# Altium project fydp_proto1.PrjPcb (part 1 of 2)
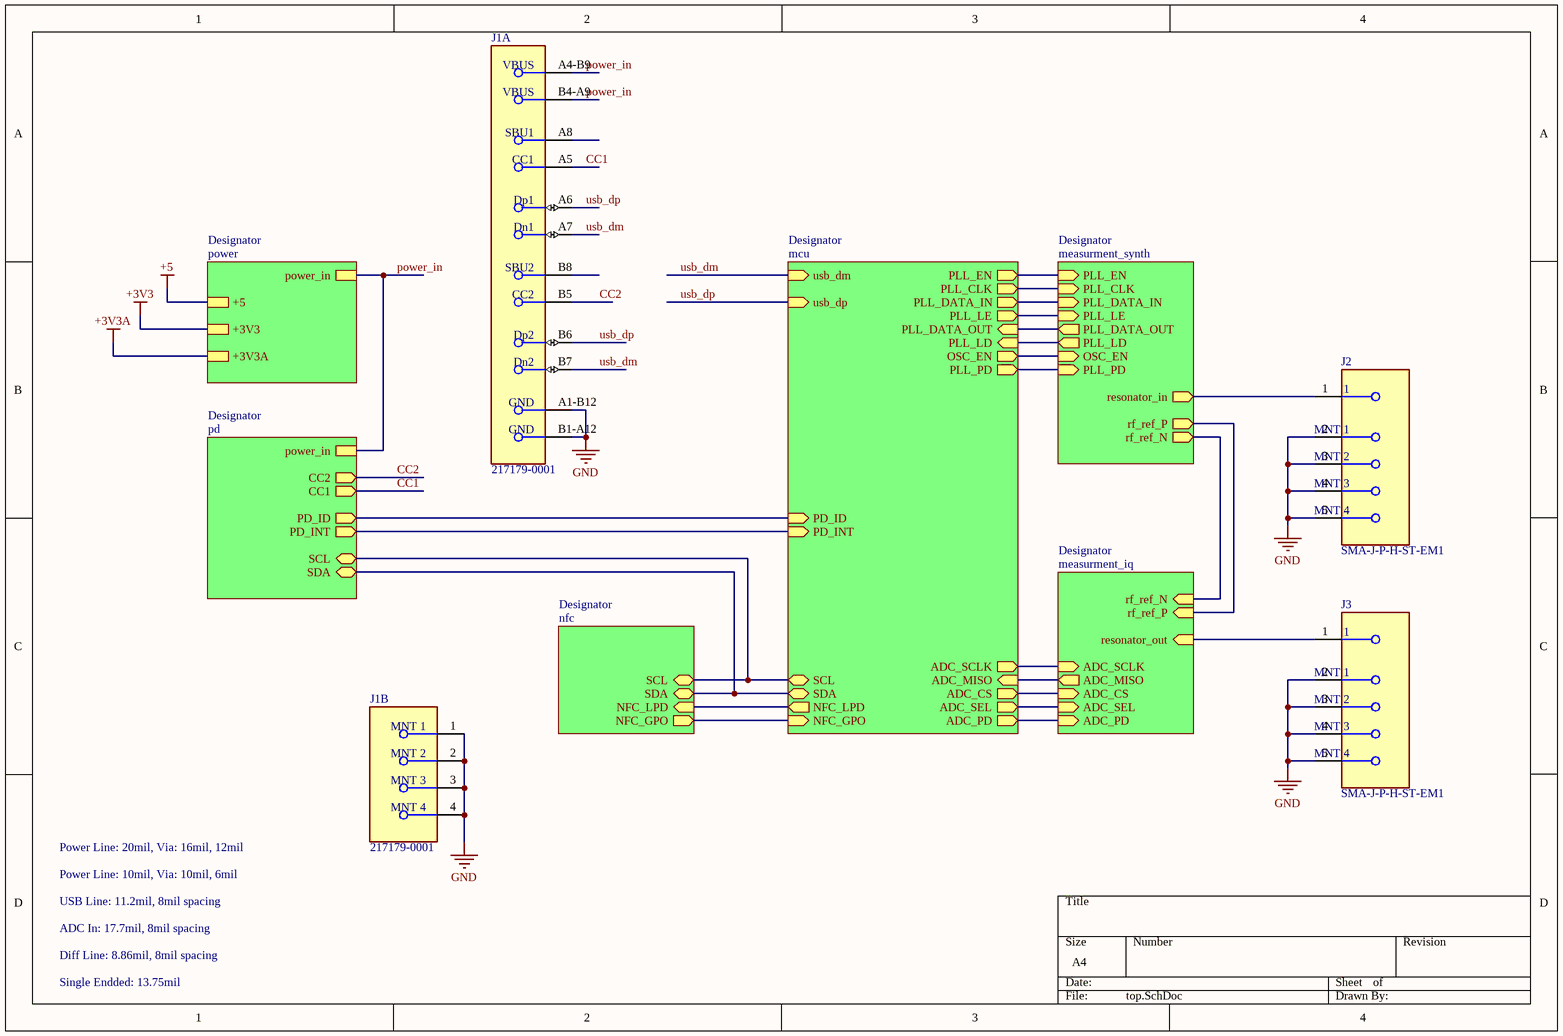
[diagram p0: top.SchDoc]
7 sheets, 138 parts. Net scope: hierarchical (ports join the sheet entries above them; power ports are global).
Board file: PCB1.PcbDoc
Sheets:
  top.SchDoc
    Designator = mcu.SchDoc
    Designator = measurment_synth.SchDoc
    Designator = power.SchDoc
    Designator = nfc.SchDoc
    Designator = measurment_iq.SchDoc
    Designator = pd.SchDoc

## Sheet top.SchDoc
size A4; SheetNumber: 1; SheetTotal: 7

### Parts
J1  217179-0001  [FP-2171790001-MFG]  (parts A,B of 2)
J2  SMA-J-P-H-ST-EM1  [FP-SMA-J-P-H-ST-EM1-MFG]
J3  SMA-J-P-H-ST-EM1  [FP-SMA-J-P-H-ST-EM1-MFG]

### Sub-sheets
Designator = mcu: usb_dm (in), usb_dp (in), SCL (bidir), SDA (bidir), NFC_LPD (out), NFC_GPO (in), PLL_EN (out), PLL_CLK (out), PLL_DATA_IN (out), PLL_DATA_OUT (in), PLL_LD (in), OSC_EN (out), PLL_PD (out), PLL_LE (out), ADC_SEL (out), ADC_SCLK (out), ADC_MISO (in), ADC_CS (out), ADC_PD (out), PD_INT (in), PD_ID (in)
Designator = measurment_synth: PLL_EN (in), PLL_CLK (in), PLL_DATA_IN (in), PLL_LE (in), PLL_DATA_OUT (out), PLL_LD (out), OSC_EN (in), PLL_PD (in), resonator_in (out), rf_ref_P (out), rf_ref_N (out)
Designator = power: power_in, +3V3, +3V3A, +5
Designator = nfc: NFC_GPO (out), NFC_LPD (in), SCL (bidir), SDA (bidir)
Designator = measurment_iq: resonator_out (in), ADC_SEL (in), ADC_SCLK (in), ADC_MISO (out), ADC_CS (in), ADC_PD (in), rf_ref_P (in), rf_ref_N (in)
Designator = pd: CC1 (out), CC2 (out), SCL (bidir), SDA (bidir), power_in, PD_INT (out), PD_ID (out)

### Nets
GND: J1.1(MNT_1) J1.2(MNT_2) J1.3(MNT_3) J1.4(MNT_4) J1.A1-B12(GND) J1.B1-A12(GND) J2.2(MNT_1) J2.3(MNT_2) J2.4(MNT_3) J2.5(MNT_4) J3.2(MNT_1) J3.3(MNT_2) J3.4(MNT_3) J3.5(MNT_4)
CC1: J1.A5(CC1) ; sheet Designator/CC1
CC2: J1.B5(CC2) ; sheet Designator/CC2
power_in: J1.A4-B9(VBUS) J1.B4-A9(VBUS) ; sheet Designator/power_in, sheet Designator/power_in
rf_ref_N: sheet Designator/rf_ref_N, sheet Designator/rf_ref_N
rf_ref_P: sheet Designator/rf_ref_P, sheet Designator/rf_ref_P
SCL: sheet Designator/SCL, sheet Designator/SCL, sheet Designator/SCL
SDA: sheet Designator/SDA, sheet Designator/SDA, sheet Designator/SDA
usb_dm: J1.A7(Dn1) J1.B7(Dn2) ; sheet Designator/usb_dm
usb_dp: J1.A6(Dp1) J1.B6(Dp2) ; sheet Designator/usb_dp
NetB1_1: J2.1 ; sheet Designator/resonator_in
NetB2_1: J3.1 ; sheet Designator/resonator_out
NetR11_1: sheet Designator/PD_ID, sheet Designator/PD_ID
NetR13_1: sheet Designator/PD_INT, sheet Designator/PD_INT
NetR21_1: sheet Designator/NFC_GPO, sheet Designator/NFC_GPO
NetU1_5: sheet Designator/NFC_LPD, sheet Designator/NFC_LPD
NetU1_11: sheet Designator/ADC_MISO, sheet Designator/ADC_MISO
NetU1_12: sheet Designator/ADC_CS, sheet Designator/ADC_CS
NetU1_13: sheet Designator/ADC_SCLK, sheet Designator/ADC_SCLK
NetU1_15: sheet Designator/ADC_PD, sheet Designator/ADC_PD
NetU1_16: sheet Designator/ADC_SEL, sheet Designator/ADC_SEL
NetU1_18: sheet Designator/OSC_EN, sheet Designator/OSC_EN
NetU1_28: sheet Designator/PLL_EN, sheet Designator/PLL_EN
NetU1_29: sheet Designator/PLL_CLK, sheet Designator/PLL_CLK
NetU1_30: sheet Designator/PLL_DATA_IN, sheet Designator/PLL_DATA_IN
NetU1_31: sheet Designator/PLL_LE, sheet Designator/PLL_LE
NetU1_32: sheet Designator/PLL_DATA_OUT, sheet Designator/PLL_DATA_OUT
NetU1_34: sheet Designator/PLL_LD, sheet Designator/PLL_LD
NetU1_35: sheet Designator/PLL_PD, sheet Designator/PLL_PD

Not connected (* = marked no-connect by the designer): J1 A8(SBU1) B8(SBU2)

### Notes on the sheet
- Power Line: 20mil, Via: 16mil, 12mil
- Power Line: 10mil, Via: 10mil, 6mil
- USB Line: 11.2mil, 8mil spacing
- Diff Line: 8.86mil, 8mil spacing
- Single Endded: 13.75mil
- ADC In: 17.7mil, 8mil spacing

### Library data of the parts
J1 = CMP-04767-000028-2: CONN RCP USB2.0 TYP C 24P SMD RA; NexarPartId: 117190526; Gender: Receptacle; Number of Contacts: 16; Current Rating: 1.25A; Voltage Rating: 30V; Min Operating Temperature: -40°C; USB Standard: USB 2.0; Height: 3.36mm; Contact Material: Gold, Nickel; Max Operating Temperature: 85°C
J2 J3 = CMP-02754-000006-1: CONN SMA JACK STR 50OHM EDGE MNT; Dielectric Material: PTFE; Center Contact Plating: Gold; Max Frequency: 6GHz; Body Material: Brass; Voltage Rating: 335V; Impedance: 50R; Package Quantity: 1; Case/Package: SMA; Max Operating Temperature: 125°C; Fastening Type: Threaded; Orientation: Straight; Depth: 13.33mm; RoHS Compliant: Yes; Length: 6.35mm; Insulation Material: Polytetrafluoroethylene; Termination: Solder; Min Operating Temperature: -65°C; Housing Color: Gold; Contact Plating: Gold; Contact Material: Copper; Connector Type: SMA; Mount: Edge; Series: SMA; Packaging: Tray; Body Plating: Gold; Radiation Hardening: No

## Sheet mcu.SchDoc
size A4; SheetNumber: 2; SheetTotal: 7
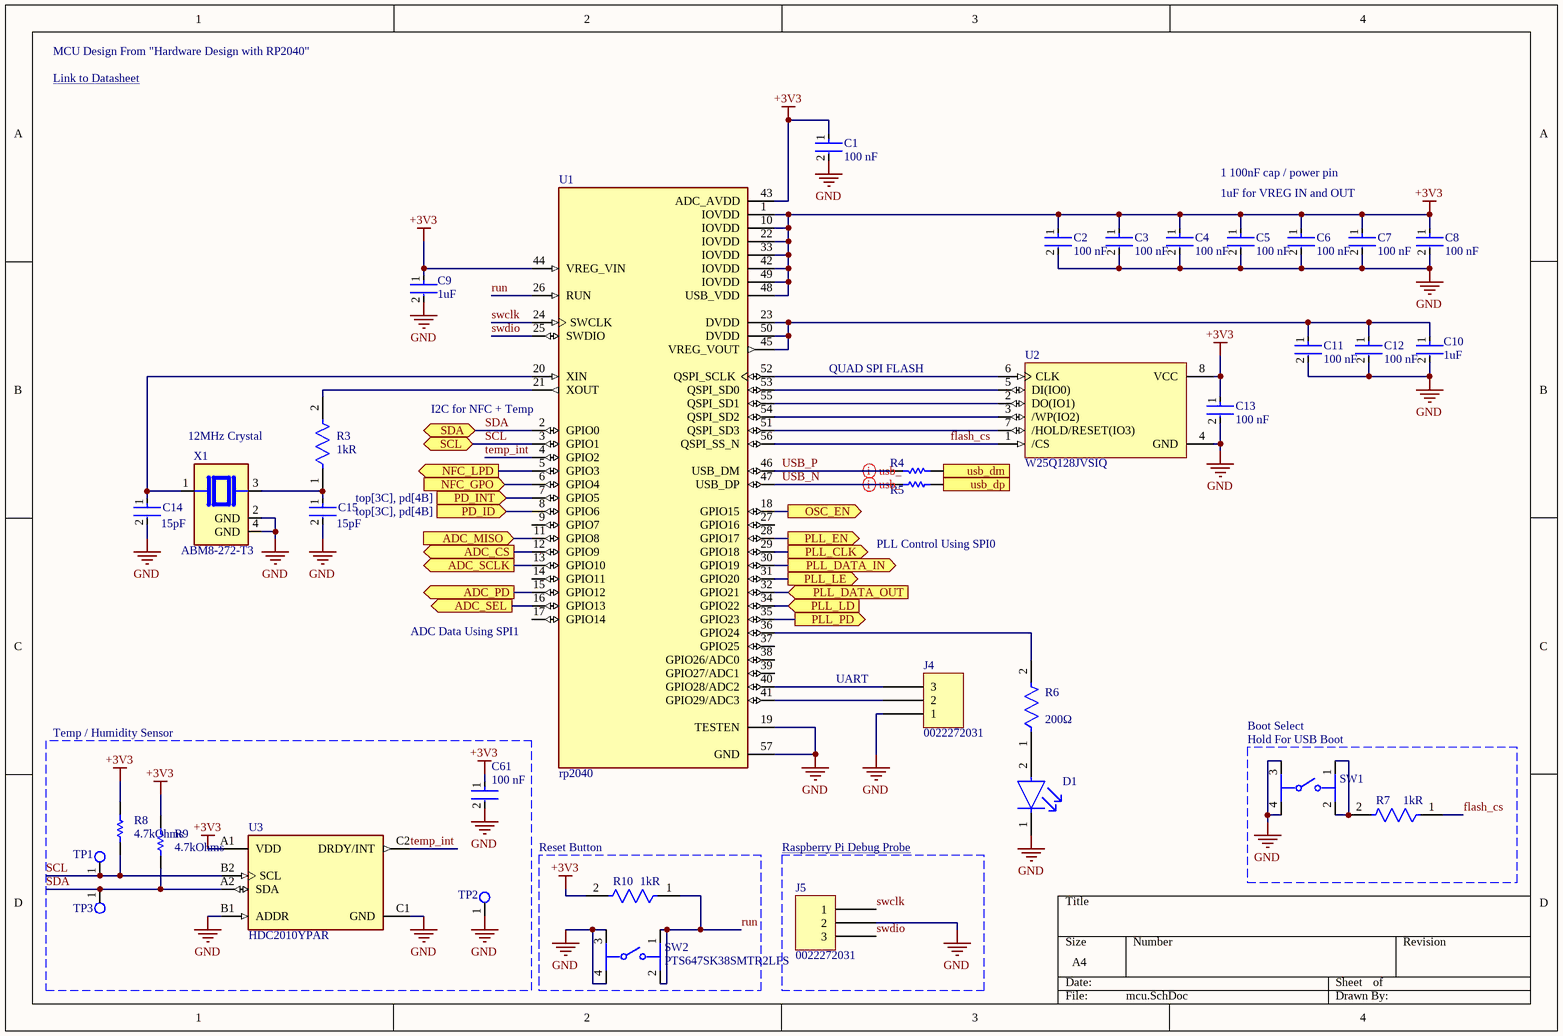
[diagram p1: mcu.SchDoc]

### Parts
C1  Capacitance: 100 nF  [FP-CC0603-DA-MFG]  (hidden comment: CC0603KRX7R7BB104)
C2  Capacitance: 100 nF  [FP-CC0603-DA-MFG]  (hidden comment: CC0603KRX7R7BB104)
C3  Capacitance: 100 nF  [FP-CC0603-DA-MFG]  (hidden comment: CC0603KRX7R7BB104)
C4  Capacitance: 100 nF  [FP-CC0603-DA-MFG]  (hidden comment: CC0603KRX7R7BB104)
C5  Capacitance: 100 nF  [FP-CC0603-DA-MFG]  (hidden comment: CC0603KRX7R7BB104)
C6  Capacitance: 100 nF  [FP-CC0603-DA-MFG]  (hidden comment: CC0603KRX7R7BB104)
C7  Capacitance: 100 nF  [FP-CC0603-DA-MFG]  (hidden comment: CC0603KRX7R7BB104)
C8  Capacitance: 100 nF  [FP-CC0603-DA-MFG]  (hidden comment: CC0603KRX7R7BB104)
C9  Capacitance: 1uF  [FP-CL10-IPC_C]  (hidden comment: CL10B105KP8NNNC)
C10  Capacitance: 1uF  [FP-CL10-IPC_C]  (hidden comment: CL10B105KP8NNNC)
C11  Capacitance: 100 nF  [FP-CC0603-DA-MFG]  (hidden comment: CC0603KRX7R7BB104)
C12  Capacitance: 100 nF  [FP-CC0603-DA-MFG]  (hidden comment: CC0603KRX7R7BB104)
C13  Capacitance: 100 nF  [FP-CC0603-DA-MFG]  (hidden comment: CC0603KRX7R7BB104)
C14  Capacitance: 15pF  [FP-GJM155-0_05-MFG]  (hidden comment: GJM1555C1H150GB01D)
C15  Capacitance: 15pF  [FP-GJM155-0_05-MFG]  (hidden comment: GJM1555C1H150GB01D)
C61  Capacitance: 100 nF  [FP-CC0603-DA-MFG]  (hidden comment: CC0603KRX7R7BB104)
D1  LTST-C190KRKT  [FP-LTST-C190KRKT-MFG]  (value not drawn)
J4  0022272031  [MOLEX KK 0022272031]
J5  0022272031  [MOLEX KK 0022272031]
R3  Resistance: 1kR  [FP-RC0603-0_55-IPC_C]  (hidden comment: RC0603FR-071KL)
R4  RC0402JR-0727RL  [RESC1005X40X25NL05T10]  (value not drawn)
R5  RC0402JR-0727RL  [RESC1005X40X25NL05T10]  (value not drawn)
R6  value 200Ω  [FP-RT0402-MFG]  (hidden comment: RT0402BRD07200RL)
R7  Resistance: 1kR  [FP-RC0603-0_55-IPC_C]  (hidden comment: RC0603FR-071KL)
R8  Resistance: 4.7kOhms  [RESC1608X55X25LL10T15]  (hidden comment: RC0603FR-074K7L)
R9  Resistance: 4.7kOhms  [RESC1608X55X25LL10T15]  (hidden comment: RC0603FR-074K7L)
R10  Resistance: 1kR  [FP-RC0603-0_55-IPC_C]  (hidden comment: RC0603FR-071KL)
SW1  PTS647SK38SMTR2LFS  [FP-PTS647SK38SMTR2LFS-MFG]  (value not drawn)
SW2  PTS647SK38SMTR2LFS  [FP-PTS647SK38SMTR2LFS-MFG]
TP1  Test Point  [test_point]  (value not drawn)
TP2  Test Point  [test_point]  (value not drawn)
TP3  Test Point  [test_point]  (value not drawn)
U1  rp2040  [QFN40P700X700X90-57N]
U2  W25Q128JVSIQ  [SOIC127P790X216-8N]
U3  HDC2010YPAR  [FP-YPA0006-MFG]
X1  ABM8-272-T3  [XTAL_ABM8-272-T3]

### Blocks framed on the sheet
Temp / Humidity Sensor: C61 R8 R9 TP1-TP3 U3
Reset Button: R10 SW2
Raspberry Pi Debug Probe: J5

### Ports
ADC_CS (out, see top[3C], measurment_iq[4B]), ADC_MISO (in, see top[3C], measurment_iq[4B]), ADC_PD (out, see top[3C], measurment_iq[4C]), ADC_SCLK (out, see top[3C], measurment_iq[4B]), ADC_SEL (out, see top[3C], measurment_iq[4C]), NFC_GPO (in, see top[3C], nfc[3B]), NFC_LPD (out, see top[3C], nfc[2B]), OSC_EN (out, see top[3B], measurment_synth[1B]), PD_ID (in, see top[3C], pd[4B]), PD_INT (in, see top[3C], pd[4B]), PLL_CLK (out, see top[3B], measurment_synth[2C]), PLL_DATA_IN (out, see top[3B], measurment_synth[2C]), PLL_DATA_OUT (in, see top[3B], measurment_synth[3C]), PLL_EN (out, see top[3B], measurment_synth[2B]), PLL_LD (in, see top[3B], measurment_synth[3B]), PLL_LE (out, see top[3B], measurment_synth[2C]), PLL_PD (out, see top[3B], measurment_synth[2B]), SCL (bidir, see top[3C], nfc[1B], pd[2C]), SDA (bidir, see top[3C], nfc[1B], pd[2C]), usb_dm (in, see top[3B]), usb_dp (in, see top[3B])

### Nets
+3V3: C1.1 C2.1 C3.1 C4.1 C5.1 C6.1 C7.1 C8.1 C9.1 C13.1 C61.1 R8.2 R9.2 R10.2 U1.1(IOVDD) U1.10(IOVDD) U1.22(IOVDD) U1.33(IOVDD) U1.42(IOVDD) U1.43(ADC_AVDD) U1.44(VREG_VIN) U1.48(USB_VDD) U1.49(IOVDD) U2.8(VCC) U3.A1(VDD)
GND: C1.2 C2.2 C3.2 C4.2 C5.2 C6.2 C7.2 C8.2 C9.2 C10.2 C11.2 C12.2 C13.2 C14.2 C15.2 C61.2 D1.1(C) J4.1 J5.2 SW1.3 SW1.4 SW2.3 SW2.4 TP2.1 U1.19(TESTEN) U1.57(GND) U2.4(GND) U3.B1(ADDR) U3.C1(GND) X1.2(GND) X1.4(GND)
flash_cs: R7.1 U1.56(QSPI_SS_N) U2.1(/CS)
run: R10.1 SW2.1 SW2.2 U1.26(RUN)
SCL: R8.1 TP1.1 U1.3(GPIO1) U3.B2(SCL) ; port SCL
SDA: R9.1 TP3.1 U1.2(GPIO0) U3.A2(SDA) ; port SDA
swclk: J5.1 U1.24(SWCLK)
swdio: J5.3 U1.25(SWDIO)
temp_int: U1.4(GPIO2) U3.C2(DRDY/INT)
usb_dm: R4.2 ; port usb_dm
usb_dp: R5.2 ; port usb_dp
USB_N: R5.1 U1.47(USB_DP)
USB_P: R4.1 U1.46(USB_DM)
NetC10_1: C10.1 C11.1 C12.1 U1.23(DVDD) U1.45(VREG_VOUT) U1.50(DVDD)
NetC14_1: C14.1 U1.20(XIN) X1.1
NetC15_1: C15.1 R3.1 X1.3
NetD1_2: D1.2(A) R6.1
NetJ4_2: J4.2 U1.41(GPIO29/ADC3)
NetJ4_3: J4.3 U1.40(GPIO28/ADC2)
NetR3_2: R3.2 U1.21(XOUT)
NetR6_2: R6.2 U1.36(GPIO24)
NetR7_2: R7.2 SW1.1 SW1.2
NetR11_1: U1.8(GPIO6) ; port PD_ID
NetR13_1: U1.7(GPIO5) ; port PD_INT
NetR21_1: U1.6(GPIO4) ; port NFC_GPO
NetU1_5: U1.5(GPIO3) ; port NFC_LPD
NetU1_11: U1.11(GPIO8) ; port ADC_MISO
NetU1_12: U1.12(GPIO9) ; port ADC_CS
NetU1_13: U1.13(GPIO10) ; port ADC_SCLK
NetU1_15: U1.15(GPIO12) ; port ADC_PD
NetU1_16: U1.16(GPIO13) ; port ADC_SEL
NetU1_18: U1.18(GPIO15) ; port OSC_EN
NetU1_28: U1.28(GPIO17) ; port PLL_EN
NetU1_29: U1.29(GPIO18) ; port PLL_CLK
NetU1_30: U1.30(GPIO19) ; port PLL_DATA_IN
NetU1_31: U1.31(GPIO20) ; port PLL_LE
NetU1_32: U1.32(GPIO21) ; port PLL_DATA_OUT
NetU1_34: U1.34(GPIO22) ; port PLL_LD
NetU1_35: U1.35(GPIO23) ; port PLL_PD
NetU1_51: U1.51(QSPI_SD3) U2.7(/HOLD/RESET(IO3))
NetU1_52: U1.52(QSPI_SCLK) U2.6(CLK)
NetU1_53: U1.53(QSPI_SD0) U2.5(DI(IO0))
NetU1_54: U1.54(QSPI_SD2) U2.3(/WP(IO2))
NetU1_55: U1.55(QSPI_SD1) U2.2(DO(IO1))

Not connected (* = marked no-connect by the designer): U1 9(GPIO7) 14(GPIO11) 17(GPIO14) 27(GPIO16) 37(GPIO25) 38(GPIO26/ADC0) 39(GPIO27/ADC1)

### Layout directives
differential pair: USB_N, USB_P

### Notes on the sheet
- MCU Design From "Hardware Design with RP2040"
- Link to Datasheet <https://datasheets.raspberrypi.com/rp2040/hardware-design-with-rp2040.pdf>
- 1 100nF cap / power pin
- 1uF for VREG IN and OUT
- QUAD SPI FLASH
- 12MHz Crystal
- (near U1) I2C for NFC + Temp
- PLL Control Using SPI0
- (near U1) ADC Data Using SPI1
- UART
- (near SW1) Hold For USB Boot
- Boot Select

### Library data of the parts
C1-C8 C11-C13 C61 = CMP-2000-05002-2: CAP CER 0.1UF 16V X7R 0603; Manufacturer: YAGEO; Tolerance: 0.1; Value: 100 nF; Temperature Coefficient: 15%; Material: Ceramic; Voltage Rating: 16 V; Package: CC0603-DA; ComponentLink2Description: Datasheet; Octopart: https://octopart.com/cc0603krx7r7bb104-yageo-192941; Temperature Range High: +125°C; Digikey Description: CAP CER 0.1UF 16V X7R 0603; Voltage: 16 V; Device Class L2: Capacitors; Height: 0.9mm; Temperature: -55°C to +125°C; Manufacturer Part Number: CC0603KRX7R7BB104; Device Class L1: Passive Components; Device Class L3: Ceramic Capacitors; ComponentLink2URL: http://www.yageo.com/documents/recent/UPY-GPHC_X7R_6.3V-to-50V_18.pdf; Footprint Url: http://www.yageo.com/exep/pages/download/literatures/UPY-C_GEN_24.pdf; RoHS: TRUE; Temperature Range Low: -55°C; Temperature Characteristic: X7R; Lead Free: Yes; Category: Cap; Mouser Description: Multilayer Ceramic Capacitor, CC Series, 0.1 - F, - 10%, X7R, 16 V, 0603 [1608 Metric]; Automotive: No
C9 C10 = CMP-2000-06094-2: Cap Ceramic 1uF 10V X7R ±10% Pad SMD 0603 +125°C T/R; Packaging: Tape and Reel; Depth: 0.8mm; Voltage Rating: 10V; Lead Free: Lead Free; Radiation Hardening: No; Length: 1.6mm; Package Quantity: 1; Mount: Surface Mount; Case/Package: 0603; Max Operating Temperature: 125°C; Case Code (Metric): 1608; Height: 0.8mm; Min Operating Temperature: -55°C; Dielectric: X7R; Contact Plating: Tin; Case Code (Imperial): 0603; Thickness: 0.035inch; Voltage Rating (DC): 10V; Tolerance: 10%; Width: 0.031inch
C14 C15 = CMP-2008-03803-2: Multi-Layer Ceramic Capacitor 15pF C0G  ±2% 0402 Paper T/R; Voltage Rating: 50V; Termination: SMD/SMT; Min Operating Temperature: -55°C; Case Code (Imperial): 0402; Depth: 0.5mm; Case/Package: 0402; Max Operating Temperature: 125°C; Lead Free: Lead Free; Width: 0.02inch; Mount: Surface Mount; Radiation Hardening: No; Case Code (Metric): 1005; Length: 1mm; Height: 0.5mm; Package Quantity: 10000; Packaging: Tape and Reel; Voltage Rating (DC): 50V; Tolerance: 2%; Dielectric: C0G; Thickness: 0.022inch
D1 = CMP-1674-00011-2: LED RED CLEAR CHIP SMD; Reverse Voltage: 5V; Viewing Angle: 130°; Power Rating: 75mW; Test Current: 20mA; Number of Elements: 1; Lens Color: Colorless; Wavelength: 639nm; Dominant Wavelength: 631nm; Lens Style: Diffused; Forward Current: 30mA; Forward Voltage: 2.4V; Luminous Intensity: 54mcd; Color: Red; Case Code (Imperial): 0603; Lens Transparency: Clear; Lead Free: Lead Free; Package Quantity: 1; Packaging: Tape and Reel; Max Operating Temperature: 85°C; Number of Pins: 2; Height: 0.8mm; Case/Package: 0603; Number of LEDs: 1; Width: 0.8mm; Case Code (Metric): 1608; Depth: 0.8mm; Mount: Surface Mount; Radiation Hardening: No; Length: 1.6mm; Illumination Color: Red; Power Dissipation: 75mW; Min Operating Temperature: -55°C
J4 J5 = 0022272031: CONN HEADER VERT 3POS 2.54MM; Manufacturer: Molex; Contact Length - Mating: 0.295" (7.49mm); Contact Length - Post: 0.140" (3.56mm); Material Flammability Rating: UL94 V-0; Number of Positions: 3; Number of Positions Loaded: All; Overall Contact Length: 0.560" (14.22mm); Pitch - Mating: 0.100" (2.54mm); Shrouding: Shrouded - 1 Wall; Style: Board to Cable/Wire; Part Number: 0022272031; ComponentLink1Description: Datasheet; ComponentLink1URL: https://www.molex.com/pdm_docs/sd/022272031_sd.pdf; ComponentLink2Description: DigiKey Link; ComponentLink2URL: http://digikey.com/product-detail/en/molex/0022272031/WM4112-ND/1130578; Connector Type: Header; Contact Finish - Mating: Tin; Contact Finish - Post: Tin; Contact Finish Thickness - Mating: 100.0µin (2.54µm); Contact Material: Brass; Contact Shape: Square; Contact Type: Male Pin; Fastening Type: Friction Lock; Insulation Color: Natural; Insulation Height: 0.461" (11.70mm); Insulation Material: Polyamide (PA), Nylon; LastUpdated: 1/12/2020 11:51:54 PM; Lifecycle Status: Active; Minimum Order: 1; Mounting Type: Through Hole; Number of Rows: 1; Packaging: Bulk; PartId: 77; Part Status: Active; Price: 0.37; Series: KK 6410; Supplier 1: DigiKey; Supplier Part Number 1: WM4112-ND; Termination: Solder
R3 R7 R10 = CMP-1659-00009-5: RES 1K OHM 1% 1/10W 0603; Voltage Rating: 50V; Power Rating: 100mW; Temperature Coefficient: 100ppm/°C; Military Standard: Not; REACH SVHC: No SVHC; Size Code: 0603; Features: Moisture Resistant; Number of Terminations: 2; Technology: THICK FILM; Series: RC; Case Code (Metric): 1608; Resistance Tolerance: 1%; Resistor Type: Thick Film; Termination: SMD/SMT; Contact Plating: Tin; Radiation Hardening: No; Min Operating Temperature: -55°C; Max Operating Temperature: 155°C; Packaging: Tape and Reel; Max Power Dissipation: 100mW; RoHS Compliant: Yes; Height: 0.45mm; Lead Free: Lead Free; Case/Package: 0603; Length: 1.6mm; Tolerance: 1%; Case Code (Imperial): 0603; Construction: Rectangular; Depth: 0.8mm
R4 R5 = CMP-1011-00036-2: Manufacturer: Yageo / Phycomp; Part Number: RC0402JR-0727RL
R6 = CMP-03412-023045-1: RES SMD 200 OHM 0.1% 1/16W 0402; Manufacturer: Yageo; Tolerance: 0.001; Voltage Rating: 50V; Temperature Coefficient: 25 ppm/°C; Power Rating: 0.063W; Device Class L2: Resistors; RoHS: TRUE; Series: RT; Resistance: 200Ω; Mouser Description: Thin Film Resistors - SMD 1/16W 200 ohm .1% 25ppm; Manufacturer Part Number: RT0402BRD07200RL; Footprint Url: http://www.yageo.com/exep/pages/download/literatures/PYu-R_Mount_10.pdf; ComponentLink2URL: http://www.yageo.com/documents/recent/PYu-RT_1-to-0.01_RoHS_L_9.pdf; Device Class L1: Passive Components; Height: 0.35mm; Temperature: -55°C to +155°C; Temperature Range High: +155°C; Package: RT0402; Device Class L3: Chip SMD Resistors; Lead Free: Yes; Ipc Land Pattern Name: RESC10050X30; Category: Res; Digikey Description: RES SMD 200 OHM 0.1% 1/16W 0402; Automotive: No; ComponentLink2Description: Datasheet; Composition: Thin Film; Temperature Range Low: -55°C; Octopart: https://octopart.com/rt0402brd07200rl-yageo-1238579
R8 R9 = CMP-2000-06942-1: Chip Resistor, 4.7 KOhm, +/- 1%, 0.1 W, -55 to 155 degC, 0603 (1608 Metric), RoHS, Tape and Reel; Manufacturer: Yageo; Power Rating: 100mW; Temperature Coefficient: 100PPM/C; Voltage Rating: 50V; Package Reference: 0603; Series: RC; Datasheet Version: Rev. 7, 05/2017; Packaging: Reel; Termination Style: SMD/SMT; Datasheet URL: http://www.yageo.com/documents/recent/PYu-RC_Group_51_RoHS_L_7.pdf; Manufacturer URL: http://www.yageo.com/; Package Description: 2-Pin Surface Mount Device, Body 1.6 x 0.8 mm; Case Code - mm: 1608; Case Code - in: 0603; Mounting Technology: SurfaceMount; Operating Temperature Range: -55Cto+155C; Tolerance: 1%; Product: ThickFilmResistorsGeneralPurpose
SW1 SW2 = CMP-10040-000033-1: TACT 4.5 X 4.5, 3.8 MM H, 2.5N,; Switch Function: Off-Mom; Switch Travel: 0.25mm; Actuator Type: Standard; Illumination Type: Non-Illuminated; Mechanical Life: 100000Cycles; Ratings: IP40; Operating Force: 250gf; Throw Configuration: SPST; Max Operating Temperature: 70°C; Min Operating Temperature: -20°C; Termination: Gull Wing; Mount: Surface Mount; Packaging: Tape and Reel
U3 = CMP-04948-000007-1: GEN 2 HUMIDITY SENSOR; Manufacturer: Texas Instruments; Resolution: 14bits; Sensor Output: I2C; Operating Supply Current: 0.105-650uA; Accuracy: 2%; Min Supply Voltage: 1.62V; Max Supply Voltage: 3.6V; Standoff Height: 0.215mm; Digikey Description: GEN 2 HUMIDITY SENSOR; ComponentLink2URL: http://www.ti.com/lit/ds/symlink/hdc2010.pdf; ComponentLink2Description: Datasheet; RoHS: TRUE; Category: IC; Automotive: No; Ipc Land Pattern Name: BGA6N50P2X3_146X146X67; Device Class L1: Sensors; Height: 0.675mm; Mouser Description: Low Power Humidity and Temperature Digital Sensor 6-DSBGA -40 to 85; Package: YPA0006; Manufacturer Part Number: HDC2010YPAR; Temperature: -40°C to +85°C; Device Class L3: unset; Temperature Range High: +85°C; Lead Free: Yes; Interface: I2C; Device Class L2: Temperature and Humidity Sensors; Temperature Range Low: -40°C; Octopart: https://octopart.com/hdc2010ypar-texas+instruments-84791680

## Sheet measurment_synth.SchDoc
size A4; SheetNumber: 4; SheetTotal: 7
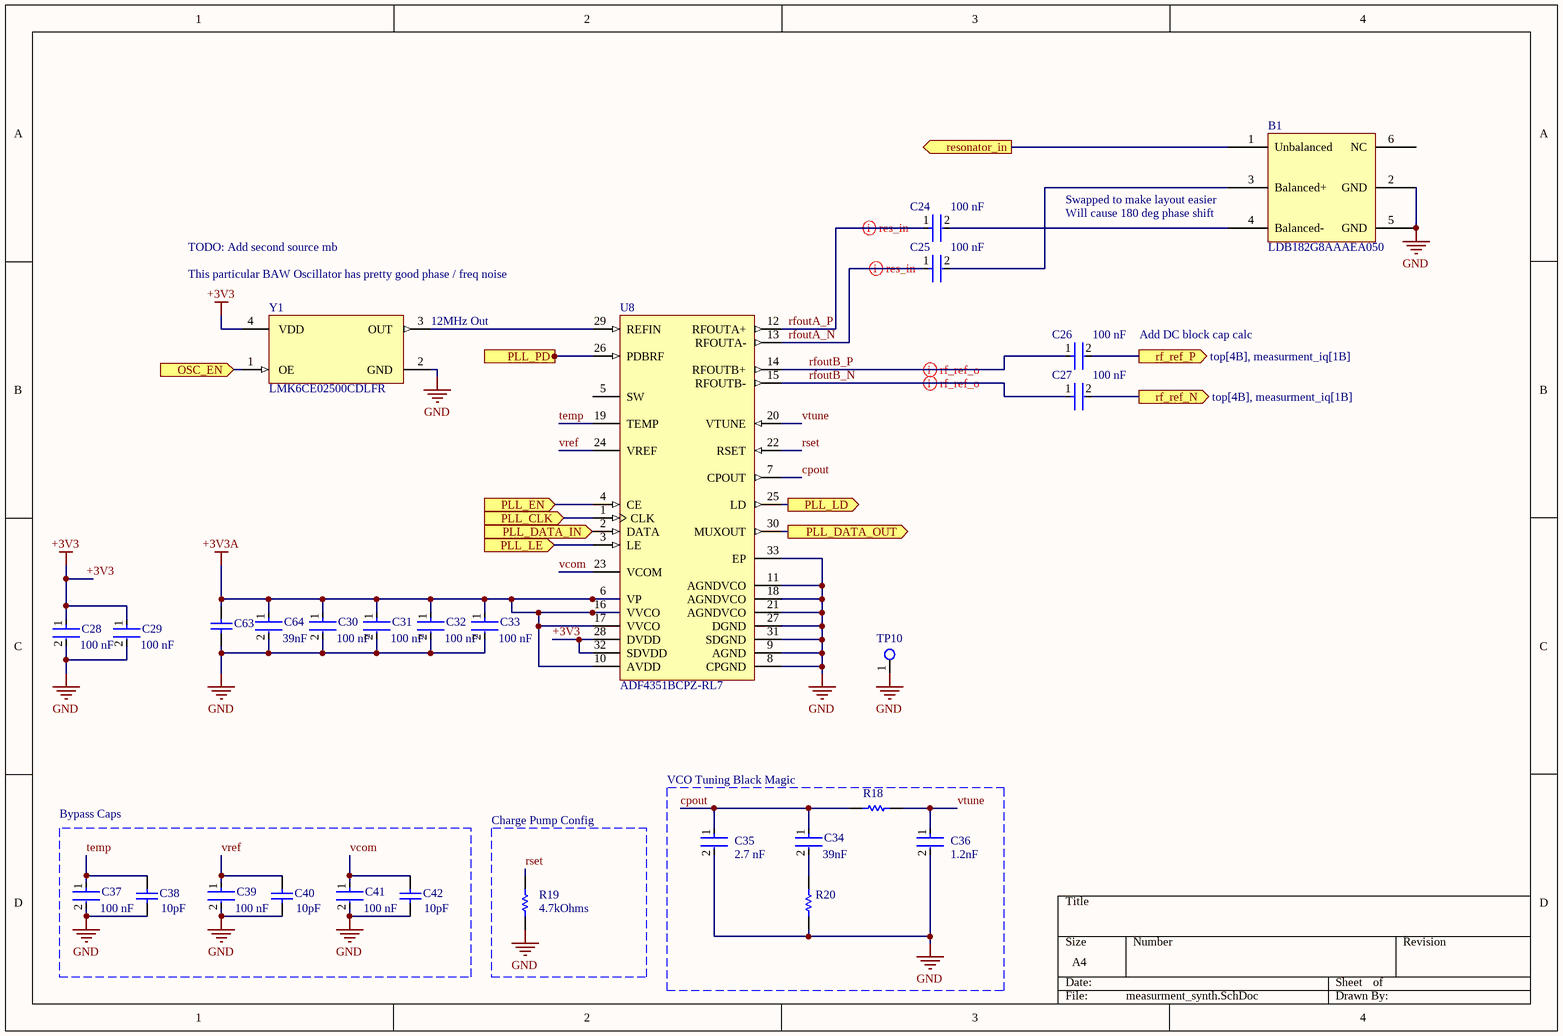
[diagram p2: measurment_synth.SchDoc]

### Parts
B1  LDB182G8AAAEA050  [Balum]
C24  Capacitance: 100 nF  [FP-CC0603-DA-MFG]  (hidden comment: CC0603KRX7R7BB104)
C25  Capacitance: 100 nF  [FP-CC0603-DA-MFG]  (hidden comment: CC0603KRX7R7BB104)
C26  Capacitance: 100 nF  [FP-CC0603-DA-MFG]  (hidden comment: CC0603KRX7R7BB104)
C27  Capacitance: 100 nF  [FP-CC0603-DA-MFG]  (hidden comment: CC0603KRX7R7BB104)
C28  Capacitance: 100 nF  [FP-CC0603-DA-MFG]  (hidden comment: CC0603KRX7R7BB104)
C29  Capacitance: 100 nF  [FP-CC0603-DA-MFG]  (hidden comment: CC0603KRX7R7BB104)
C30  Capacitance: 100 nF  [FP-CC0603-DA-MFG]  (hidden comment: CC0603KRX7R7BB104)
C31  Capacitance: 100 nF  [FP-CC0603-DA-MFG]  (hidden comment: CC0603KRX7R7BB104)
C32  Capacitance: 100 nF  [FP-CC0603-DA-MFG]  (hidden comment: CC0603KRX7R7BB104)
C33  Capacitance: 100 nF  [FP-CC0603-DA-MFG]  (hidden comment: CC0603KRX7R7BB104)
C34  Capacitance: 39nF  [FP-GCM155-0_05-IPC_B]  (hidden comment: GCM155R71C393KA37D)
C35  Capacitance: 2.7 nF  [FP-CC0402-MFG]  (hidden comment: CC0402KPX7R9BB272)
C36  Capacitance: 1.2nF  [FP-GCM188-0_1-IPC_A]  (hidden comment: GCM1885C1H122JA16J)
C37  Capacitance: 100 nF  [FP-CC0603-DA-MFG]  (hidden comment: CC0603KRX7R7BB104)
C38  Capacitance: 10pF  [CAPC1005X55X25ML05T05]  (hidden comment: CC0402JRNPO9BN100)
C39  Capacitance: 100 nF  [FP-CC0603-DA-MFG]  (hidden comment: CC0603KRX7R7BB104)
C40  Capacitance: 10pF  [CAPC1005X55X25ML05T05]  (hidden comment: CC0402JRNPO9BN100)
C41  Capacitance: 100 nF  [FP-CC0603-DA-MFG]  (hidden comment: CC0603KRX7R7BB104)
C42  Capacitance: 10pF  [CAPC1005X55X25ML05T05]  (hidden comment: CC0402JRNPO9BN100)
C63  GRM1555C1H270JA01D  [CAPC1005X55X25LL05T10]  (value not drawn)
C64  Capacitance: 39nF  [FP-GCM155-0_05-IPC_B]  (hidden comment: GCM155R71C393KA37D)
R18  RC0402JR-07680RL  [RESC1005X40X25LL05T10]  (value not drawn)
R19  Resistance: 4.7kOhms  [RESC1608X55X25LL10T15]  (hidden comment: RC0603FR-074K7L)
R20  RC0603JR-07360RL  [RESC1608X55X25ML10T15]  (value not drawn)
TP10  Test Point  [test_point]  (value not drawn)
U8  ADF4351BCPZ-RL7  [ADI-CP-32-2_L]
Y1  LMK6CE02500CDLFR  [DLF0004A_MFG]

### Blocks framed on the sheet
Bypass Caps: C37-C42
Charge Pump Config: R19
VCO Tuning Black Magic: C34-C36 R18 R20

### Ports
OSC_EN (in, see top[3B], mcu[3B]), PLL_CLK (in, see top[3B], mcu[3C]), PLL_DATA_IN (in, see top[3B], mcu[3C]), PLL_DATA_OUT (out, see top[3B], mcu[3C]), PLL_EN (in, see top[3B], mcu[3C]), PLL_LD (out, see top[3B], mcu[3C]), PLL_LE (in, see top[3B], mcu[3C]), PLL_PD (in, see top[3B], mcu[3C]), resonator_in (out, see top[4B]), rf_ref_N (out, see top[4B], measurment_iq[1B]), rf_ref_P (out, see top[4B], measurment_iq[1B])

### Nets
+3V3: C28.1 C29.1 U8.28(DVDD) U8.32(SDVDD) Y1.4(VDD)
+3V3A: C30.1 C31.1 C32.1 C33.1 C63.2 C64.1 U8.6(VP) U8.10(AVDD) U8.16(VVCO) U8.17(VVCO)
GND: B1.2(GND) B1.5(GND) C28.2 C29.2 C30.2 C31.2 C32.2 C33.2 C35.2 C36.2 C37.2 C38.1 C39.2 C40.1 C41.2 C42.1 C63.1 C64.2 R19.1 R20.1 TP10.1 U8.8(CPGND) U8.9(AGND) U8.11(AGNDVCO) U8.18(AGNDVCO) U8.21(AGNDVCO) U8.27(DGND) U8.31(SDGND) U8.33(EP) Y1.2(GND)
cpout: C34.1 C35.1 R18.1 U8.7(CPOUT)
rf_ref_N: C27.2 ; port rf_ref_N
rf_ref_P: C26.2 ; port rf_ref_P
rfoutA_N: C25.1 U8.13(RFOUTA-)
rfoutA_P: C24.1 U8.12(RFOUTA+)
rfoutB_N: C27.1 U8.15(RFOUTB-)
rfoutB_P: C26.1 U8.14(RFOUTB+)
rset: R19.2 U8.22(RSET)
temp: C37.1 C38.2 U8.19(TEMP)
vcom: C41.1 C42.2 U8.23(VCOM)
vref: C39.1 C40.2 U8.24(VREF)
vtune: C36.1 R18.2 U8.20(VTUNE)
NetB1_1: B1.1(Unbalanced) ; port resonator_in
NetB1_3: B1.3(Balanced+) C25.2
NetB1_4: B1.4(Balanced-) C24.2
NetC34_2: C34.2 R20.2
NetU1_18: Y1.1(OE) ; port OSC_EN
NetU1_28: U8.4(CE) ; port PLL_EN
NetU1_29: U8.1(CLK) ; port PLL_CLK
NetU1_30: U8.2(DATA) ; port PLL_DATA_IN
NetU1_31: U8.3(LE) ; port PLL_LE
NetU1_32: U8.30(MUXOUT) ; port PLL_DATA_OUT
NetU1_34: U8.25(LD) ; port PLL_LD
NetU1_35: U8.26(PDBRF) ; port PLL_PD
NetU8_29: U8.29(REFIN) Y1.3(OUT)

Not connected (* = marked no-connect by the designer): B1 6(NC); U8 5(SW)

### Layout directives
differential pair: rfoutA_N, rfoutA_P, rfoutB_N, rfoutB_P

### Notes on the sheet
- TODO: Add second source mb
- (near B1) Swapped to make layout easier
- (near B1) Will cause 180 deg phase shift
- This particular BAW Oscillator has pretty good phase / freq noise
- (near Y1) 12MHz Out
- Add DC block cap calc

### Library data of the parts
C24-C33 C37 C39 C41 = CMP-2000-05002-2: as C1 on sheet mcu; Voltage Rating: 16 V; Package: CC0603-DA; ComponentLink2Description: Datasheet; Octopart: https://octopart.com/cc0603krx7r7bb104-yageo-192941; Temperature Range High: +125°C; Digikey Description: CAP CER 0.1UF 16V X7R 0603; Voltage: 16 V; Device Class L2: Capacitors; Height: 0.9mm; Temperature: -55°C to +125°C; Manufacturer Part Number: CC0603KRX7R7BB104; Device Class L1: Passive Components; Device Class L3: Ceramic Capacitors; ComponentLink2URL: http://www.yageo.com/documents/recent/UPY-GPHC_X7R_6.3V-to-50V_18.pdf; Footprint Url: http://www.yageo.com/exep/pages/download/literatures/UPY-C_GEN_24.pdf; RoHS: TRUE; Temperature Range Low: -55°C; Temperature Characteristic: X7R; Lead Free: Yes; Category: Cap; Mouser Description: Multilayer Ceramic Capacitor, CC Series, 0.1 - F, - 10%, X7R, 16 V, 0603 [1608 Metric]; Automotive: No
C34 C64 = CMP-06035-054841-1: Ceramic Capacitor for Automotive 39nF ±10% 16VDC X7R 0402 Paper T/R; Voltage Rating: 16V; Max Operating Temperature: 125°C; Case Code (Imperial): 0402; Mount: Surface Mount; Packaging: Cut Tape; Tolerance: 10%; Min Operating Temperature: -55°C; Ratings: AEC-Q200; Case Code (Metric): 1005; Case/Package: 0402
C35 = CMP-03422-000661-1: CC0402 2.7 nF X7R 10.00% 50 V; Manufacturer: YAGEO; Material: Ceramic; Automotive Grade: NA; Voltage Rating: 50 V; Value: 2.7 nF; Temperature Coefficient: 30ppm/°C; Tolerance: 0.1; Temperature Range Low: -55°C; Manufacturer Part Number: CC0402KPX7R9BB272; Temperature Range High: +125°C; Package: CC0402; Temperature: -55°C to +125°C; ComponentLink2Description: Datasheet; Temperature Characteristic: X7R; Lead Free: Yes; Footprint Url: http://www.yageo.com/exep/pages/download/literatures/UPY-C_GEN_24.pdf; Device Class L3: Ceramic Capacitors; RoHS: TRUE; Automotive: No; Category: Cap; Device Class L2: Capacitors; ComponentLink2URL: http://www.yageo.com/documents/recent/UPY-GP_NP0_16V-to-50V_16.pdf; Device Class L1: Passive Components; Octopart: https://octopart.com/cc0402kpx7r9bb272-yageo-84795372; Height: 0.55mm; Ipc Land Pattern Name: CAPC10050X50
C36 = CMP-06035-017544-1: Ceramic Capacitor for Automotive 1.2nF  ±5% 50VDC C0G 0603 Paper T/R; Voltage Rating: 50V; Ratings: AEC-Q200; Dielectric: C0G; Width: 0.031inch; Max Operating Temperature: 125°C; Mount: Surface Mount; Height: 0.8mm; Min Operating Temperature: -55°C; Packaging: Tape and Reel; Thickness: 0.035inch; Case/Package: 0603; Package Quantity: 10000; Weight: 0.000222oz; Case Code (Metric): 1608; Tolerance: 5%; Case Code (Imperial): 0603; Voltage Rating (DC): 50V; Termination: SMD/SMT; Length: 0.063inch
C38 C40 C42 = CMP-2100-03589-1: Chip Capacitor, 10 pF, +/- 5%, 50 V, -55 to 125 degC, 0402 (1005 Metric), RoHS, Tape and Reel; Manufacturer: Yageo; Insulation Resistance: 100GR; Voltage Rating (DC): 50V; Dielectric Material: Ceramic; Temperature Coefficient: 30ppm/degC; Dielectric: C0G; Termination: SMD/SMT; Package Reference: 0402; Lead Free: LeadFree; Composition: Ceramic; Tolerance: 5%; Case Code (Metric): 1005; Voltage Rating: 50V; Packaging: TapeandReel; Manufacturer URL: http://www.yageo.com/; REACH SVHC: NoSVHC; Max Operating Temperature: 125degC; Length: 1mm; Mount: SurfaceMount; Depth: 0.5mm; Min Operating Temperature: -55degC; Number of Pins: 2; Width: 0.02inch; Datasheet Version: Rev. 14, 07/2016; Package Quantity: 1; Datasheet URL: http://www.yageo.com/documents/recent/UPY-GP_NP0_16V-to-50V_14.pdf; Case Code (Imperial): 0402; RoHSCompliant: True; Radiation Hardening: No; Height: 0.5mm; Case/Package: 0402; Thickness: 0.022inch; Package Description: 2-Pin Surface Mount Device, Body 1 x 0.5 mm; Voltage: 50V
C63 = CMP-2008-03917-1: Manufacturer: Murata; Part Number: GRM1555C1H270JA01D
R18 = CMP-2002-08032-1: Manufacturer: Yageo / Phycomp; Part Number: RC0402JR-07680RL
R19 = CMP-2000-06942-1: as R8 on sheet mcu; Package Reference: 0603; Series: RC; Datasheet Version: Rev. 7, 05/2017; Packaging: Reel; Termination Style: SMD/SMT; Datasheet URL: http://www.yageo.com/documents/recent/PYu-RC_Group_51_RoHS_L_7.pdf; Manufacturer URL: http://www.yageo.com/; Package Description: 2-Pin Surface Mount Device, Body 1.6 x 0.8 mm; Case Code - mm: 1608; Case Code - in: 0603; Mounting Technology: SurfaceMount; Operating Temperature Range: -55Cto+155C; Tolerance: 1%; Product: ThickFilmResistorsGeneralPurpose
R20 = CMP-2000-04266-1: Manufacturer: Yageo; Part Number: RC0603JR-07360RL
U8 = CMP-0287-00015-1: Wideband Synthesizer with Integrated VCO, CP-32-2, Pb-Free, 1500 Reel; Max RF Input (MHz): 4.4GHz; RF Prescalers: 4/5,8/9; Max REFin (MHz): 250MHz; Frequency Range: 35MHz-4.4GHz; Norm Phase Noise (dBc/Hz): -221dBc; Supply Current: 110mA; Single/Dual: Single; PackageVersion: Jan-2005; ComponentLink3URL: http://www.analog.com/static/imported-files/packages/414143737956480539664569CP_32_2.pdf; PackageReference: CP-32-2; ComponentLink2URL: http://www.analog.com/static/imported-files/data_sheets/ADF4351.pdf; ComponentLink1URL: www.analog.com; ComponentLink1Description: Manufacturer URL; ComponentLink2Description: Datasheet; ComponentLink3Description: Package Specification; PackageDescription: 32-Lead Lead Frame Chip Scale Package [LFCSP_VQ]; DatasheetVersion: Rev. Pr D; Code_JEDEC: MO-220-VHHD-2
Y1 = CMP-00370-144810711-1: "LOW-JITTER, HIGH-PERFORMANCE, BU" 25 MHz LVCMOS Oscillator 1.8V Enable/Disable 4-VDFN; Manufacturer Lifecycle Status: ACTIVE; Load Capacitance: 30pF; Frequency: 25MHz; Max Junction Temperature (Tj): 125°C; Max Supply Voltage: 1.9V; Min Supply Voltage: 1.7V; Height: 1mm; Min Operating Temperature: -40°C; HelpURL: https://www.ti.com/lit/ds/symlink/lmk6c.pdf; ComponentLink1URL: http://ti.com; Number of Pins: 4; ComponentLink2Description: Datasheet URL; ComponentLink2URL: https://www.ti.com/lit/ds/symlink/lmk6c.pdf; Max Operating Temperature: 105°C; Thickness: 900µm; Ambient Temperature Range High: 105°C; Length: 2.5mm; ComponentLink1Description: Manufacturer's Website; Width: 2mm; Lifecycle Status: Production; RoHS: Compliant

## Sheet power.SchDoc
size A4; SheetNumber: 3; SheetTotal: 7
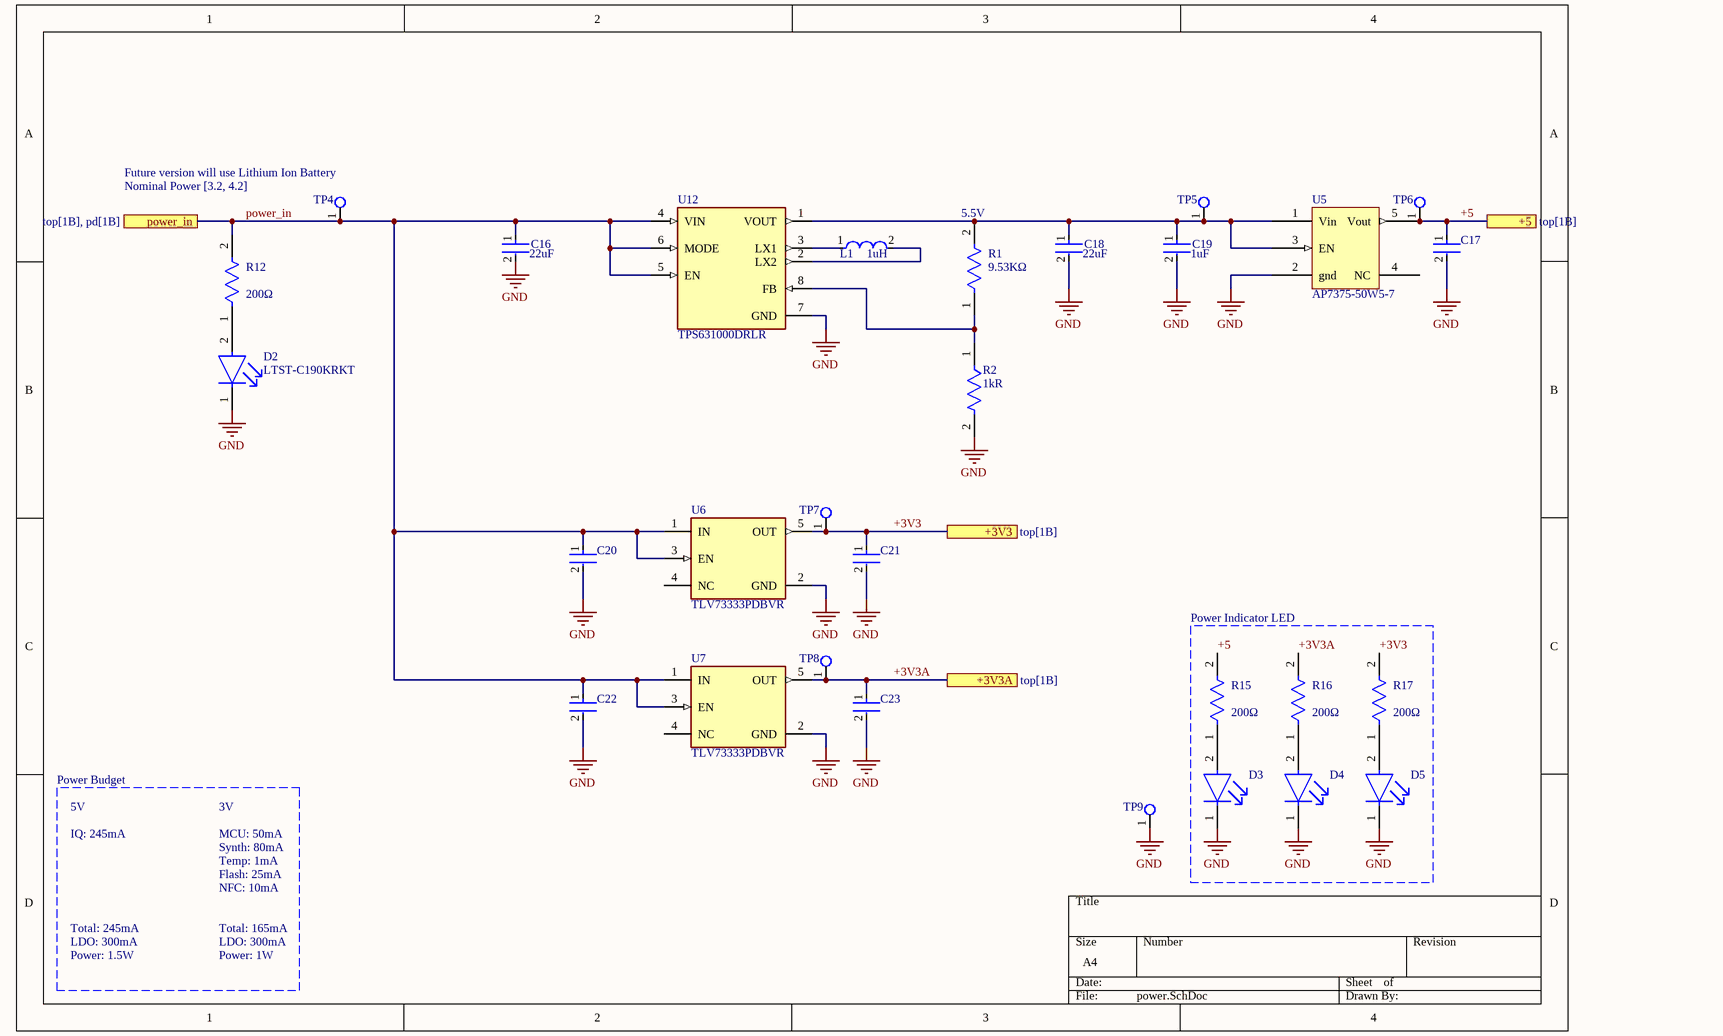
[diagram p3: power.SchDoc]

### Parts
C16  Capacitance: 22uF  [FP-GRM188-0_2-IPC_C]  (hidden comment: GRM188R61A226ME15D)
C17  GRM155R61A106ME11D  [FP-GRM155-0_2-IPC_A]  (value not drawn)
C18  Capacitance: 22uF  [FP-GRM188-0_2-IPC_C]  (hidden comment: GRM188R61A226ME15D)
C19  Capacitance: 1uF  [FP-CL10-IPC_C]  (hidden comment: CL10B105KP8NNNC)
C20  GRM155R61A106ME11D  [FP-GRM155-0_2-IPC_A]  (value not drawn)
C21  GRM155R61A106ME11D  [FP-GRM155-0_2-IPC_A]  (value not drawn)
C22  GRM155R61A106ME11D  [FP-GRM155-0_2-IPC_A]  (value not drawn)
C23  GRM155R61A106ME11D  [FP-GRM155-0_2-IPC_A]  (value not drawn)
D2  LTST-C190KRKT  [FP-LTST-C190KRKT-MFG]
D3  LTST-C190KRKT  [FP-LTST-C190KRKT-MFG]  (value not drawn)
D4  LTST-C190KRKT  [FP-LTST-C190KRKT-MFG]  (value not drawn)
D5  LTST-C190KRKT  [FP-LTST-C190KRKT-MFG]  (value not drawn)
L1  Inductance: 1uH  [FP-LQM21PH_G0-IPC_C]  (hidden comment: LQM21PN1R0NGRD)
R1  value 9.53KΩ  [FP-RT0603-MFG]  (hidden comment: RT0603BRD079K53L)
R2  Resistance: 1kR  [FP-RC0603-0_55-IPC_C]  (hidden comment: RC0603FR-071KL)
R12  value 200Ω  [FP-RT0402-MFG]  (hidden comment: RT0402BRD07200RL)
R15  value 200Ω  [FP-RT0402-MFG]  (hidden comment: RT0402BRD07200RL)
R16  value 200Ω  [FP-RT0402-MFG]  (hidden comment: RT0402BRD07200RL)
R17  value 200Ω  [FP-RT0402-MFG]  (hidden comment: RT0402BRD07200RL)
TP4  Test Point  [test_point]  (value not drawn)
TP5  Test Point  [test_point]  (value not drawn)
TP6  Test Point  [test_point]  (value not drawn)
TP7  Test Point  [test_point]  (value not drawn)
TP8  Test Point  [test_point]  (value not drawn)
TP9  Test Point  [test_point]  (value not drawn)
U5  AP7375-50W5-7  [DIODES SOT25]
U6  TLV73333PDBVR  [FP-DBV0005A-MFG]
U7  TLV73333PDBVR  [FP-DBV0005A-MFG]
U12  TPS631000DRLR  [SOT50P160X60-8N]

### Blocks framed on the sheet
Power Indicator LED: D3-D5 R15-R17

### Ports
+3V3 (see top[1B]), +3V3A (see top[1B]), +5 (see top[1B]), power_in (see top[1B], pd[1B])

### Nets
+3V3: C21.1 R17.2 TP7.1 U6.5(OUT) ; port +3V3
+3V3A: C23.1 R16.2 TP8.1 U7.5(OUT) ; port +3V3A
+5: C17.1 R15.2 TP6.1 U5.5(Vout) ; port +5
GND: C16.2 C17.2 C18.2 C19.2 C20.2 C21.2 C22.2 C23.2 D2.1(C) D3.1(C) D4.1(C) D5.1(C) R2.2 TP9.1 U5.2(gnd) U6.2(GND) U7.2(GND) U12.7(GND)
power_in: C16.1 C20.1 C22.1 R12.2 TP4.1 U6.1(IN) U6.3(EN) U7.1(IN) U7.3(EN) U12.4(VIN) U12.5(EN) U12.6(MODE) ; port power_in
NetC18_1: C18.1 C19.1 R1.2 TP5.1 U5.1(Vin) U5.3(EN) U12.1(VOUT)
NetD2_2: D2.2(A) R12.1
NetD3_2: D3.2(A) R15.1
NetD4_2: D4.2(A) R16.1
NetD5_2: D5.2(A) R17.1
NetL1_1: L1.1 U12.3(LX1)
NetL1_2: L1.2 U12.2(LX2)
NetR1_1: R1.1 R2.1 U12.8(FB)

Not connected (* = marked no-connect by the designer): U5 4(NC); U6 4(NC); U7 4(NC)

### Notes on the sheet
- (near TP4) Future version will use Lithium Ion Battery
- Nominal Power [3.2, 4.2]
- (near R1) 5.5V
- Power Budget
- 5V
- IQ: 245mA
- 3V
- MCU: 50mA
- Synth: 80mA
- Temp: 1mA
- Flash: 25mA
- NFC: 10mA
- Total: 245mA
- LDO: 300mA
- Power: 1.5W
- Total: 165mA
- Power: 1W

### Library data of the parts
C16 C18 = CMP-2000-06337-3: Chip Multilayer Ceramic Capacitors for General Purpose, 0603, 22uF, X5R, 15%, 20%, 10V; Tolerance: 20%; Weight: 0.000222oz; Material: Ceramic; Depth: 0.8mm; Length: 1.6mm; Termination: SMD/SMT; Packaging: Tape and Reel; Width: 0.8mm; Voltage Rating: 10V; Case Code (Imperial): 0603; Mount: Surface Mount; Voltage Rating (DC): 10V; Case/Package: 0603; Thickness: 0.039inch; REACH SVHC: No SVHC; Dielectric: X5R; Height: 0.8mm; Package Quantity: 4000; Case Code (Metric): 1608; Min Operating Temperature: -55°C; Lead Free: Lead Free; Max Operating Temperature: 85°C
C17 C20-C23 = CMP-06035-026070-1: Chip Multilayer Ceramic Capacitors for General Purpose, 0402, 10uF, X5R, 15%, 20%, 10V
C19 = CMP-2000-06094-2: as C9 on sheet mcu; Packaging: Tape and Reel; Depth: 0.8mm; Voltage Rating: 10V; Lead Free: Lead Free; Radiation Hardening: No; Length: 1.6mm; Package Quantity: 1; Mount: Surface Mount; Case/Package: 0603; Max Operating Temperature: 125°C; Case Code (Metric): 1608; Height: 0.8mm; Min Operating Temperature: -55°C; Dielectric: X7R; Contact Plating: Tin; Case Code (Imperial): 0603; Thickness: 0.035inch; Voltage Rating (DC): 10V; Tolerance: 10%; Width: 0.031inch
D2-D5 = CMP-1674-00011-2: as D1 on sheet mcu; Color: Red; Case Code (Imperial): 0603; Lens Transparency: Clear; Lead Free: Lead Free; Package Quantity: 1; Packaging: Tape and Reel; Max Operating Temperature: 85°C; Number of Pins: 2; Height: 0.8mm; Case/Package: 0603; Number of LEDs: 1; Width: 0.8mm; Case Code (Metric): 1608; Depth: 0.8mm; Mount: Surface Mount; Radiation Hardening: No; Length: 1.6mm; Illumination Color: Red; Power Dissipation: 75mW; Min Operating Temperature: -55°C
L1 = CMP-06042-017027-1: Multilayer Type Inductor for Power Lines, 0805 (2012), 1μH, 30%, 0.0825Ω, 1.3A; Test Frequency: 1MHz; Shielding: Shielded; Self Resonant Frequency: 50MHz; DC Resistance (DCR): 82.5mR; Core Material: Ferrite; Inductance Tolerance: 30%; Military Standard: Not; Height - Seated (Max): 0.039inch; Max DC Current: 1.3A; Depth: 1.4mm; Packaging: Tape and Reel; Mount: Surface Mount; Width: 0.049inch; Case Code (Imperial): 0805; RoHS Compliant: Yes; Height: 0.9mm; Case/Package: 0805; Max Operating Temperature: 125°C; Min Operating Temperature: -55°C; REACH SVHC: No SVHC; DC Current: 1.3A; Current Rating: 1.3A; Weight: 0.000194oz; Case Code (Metric): 2012; Termination: SMD/SMT; Length: 2mm; Series: LQM21PN_GR; Tolerance: 30%; Package Quantity: 4000
R1 = CMP-03412-004903-1: RES SMD 9.53K OHM 0.1% 1/10W; Manufacturer: Yageo; Tolerance: 0.001; Power Rating: 0.1W; Temperature Coefficient: 25 ppm/°C; Voltage Rating: 75V; Description: RT0603 9.53KΩ 0.1W 25 ppm/°C 0.10%; Device Class L3: Chip SMD Resistors; Octopart: https://octopart.com/rt0603brd079k53l-yageo-1387406; Mouser Description: Thin Film Resistors - SMD 1/10W 9.53K ohm .1% 25ppm; Temperature Range High: +155°C; Digikey Description: RES SMD 9.53K OHM 0.1% 1/10W; Lead Free: Yes; Package: RT0603; Series: RT; ComponentLink2URL: http://www.yageo.com/documents/recent/PYu-RT_1-to-0.01_RoHS_L_9.pdf; Composition: Thin Film; Automotive: No; RoHS: TRUE; Resistance: 9.53KΩ; Footprint Url: http://www.yageo.com/exep/pages/download/literatures/PYu-R_Mount_10.pdf; Temperature: -55°C to +155°C; Temperature Range Low: -55°C; Height: 0.55mm; Device Class L2: Resistors; Device Class L1: Passive Components; Category: Res; ComponentLink2Description: Datasheet; Ipc Land Pattern Name: RESC16080X45; Manufacturer Part Number: RT0603BRD079K53L
R2 = CMP-1659-00009-5: as R3 on sheet mcu; Military Standard: Not; REACH SVHC: No SVHC; Size Code: 0603; Features: Moisture Resistant; Number of Terminations: 2; Technology: THICK FILM; Series: RC; Case Code (Metric): 1608; Resistance Tolerance: 1%; Resistor Type: Thick Film; Termination: SMD/SMT; Contact Plating: Tin; Radiation Hardening: No; Min Operating Temperature: -55°C; Max Operating Temperature: 155°C; Packaging: Tape and Reel; Max Power Dissipation: 100mW; RoHS Compliant: Yes; Height: 0.45mm; Lead Free: Lead Free; Case/Package: 0603; Length: 1.6mm; Tolerance: 1%; Case Code (Imperial): 0603; Construction: Rectangular; Depth: 0.8mm
R12 R15-R17 = CMP-03412-023045-1: as R6 on sheet mcu; Device Class L2: Resistors; RoHS: TRUE; Series: RT; Resistance: 200Ω; Mouser Description: Thin Film Resistors - SMD 1/16W 200 ohm .1% 25ppm; Manufacturer Part Number: RT0402BRD07200RL; Footprint Url: http://www.yageo.com/exep/pages/download/literatures/PYu-R_Mount_10.pdf; ComponentLink2URL: http://www.yageo.com/documents/recent/PYu-RT_1-to-0.01_RoHS_L_9.pdf; Device Class L1: Passive Components; Height: 0.35mm; Temperature: -55°C to +155°C; Temperature Range High: +155°C; Package: RT0402; Device Class L3: Chip SMD Resistors; Lead Free: Yes; Ipc Land Pattern Name: RESC10050X30; Category: Res; Digikey Description: RES SMD 200 OHM 0.1% 1/16W 0402; Automotive: No; ComponentLink2Description: Datasheet; Composition: Thin Film; Temperature Range Low: -55°C; Octopart: https://octopart.com/rt0402brd07200rl-yageo-1238579
U6 U7 = CMP-04917-000053-1: IC REG LINEAR 3.3V 300MA SOT23-5; Manufacturer: Texas Instruments; Max Junction Temp: +125°C; Accuracy Percentage: 1%; Min Supply Voltage: 1.4V; Number Of Outputs: 1; Dropout Voltage: 125mV; Nominal Supply Current: 34uA; Max Supply Voltage: 5.5V; Output Type: Fixed; Standoff Height: 0mm; Digikey Description: IC REG LINEAR 3.3V 300MA SOT23-5; Manufacturer Part Number: TLV73333PDBVR; Temperature Range High: +125°C; Temperature: -40°C to +125°C; Output Current: 300mA; Mouser Description: LDO Voltage Regulators Capacitr-Free 300-mA 5-SOT-23 -40 to 125; Automotive: No; Height: 1.45mm; Device Class L3: Voltage Regulators - Linear; ComponentLink2Description: Datasheet; Device Class L1: Integrated Circuits (ICs); ComponentLink2URL: http://www.ti.com/lit/ds/symlink/tlv733p.pdf; Octopart: https://octopart.com/tlv73333pdbvr-texas+instruments-51080890; Temperature Range Low: -40°C; RoHS: TRUE; Lead Free: Yes; Output Voltage: 3.3V; Package: DBV0005A; Device Class L2: Power Management ICs; Category: IC

## Sheet nfc.SchDoc
size A4; SheetNumber: 5; SheetTotal: 7
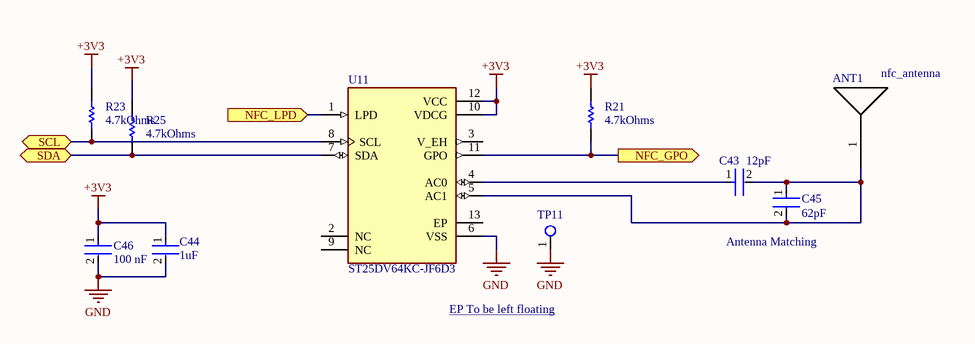
[diagram p4: nfc.SchDoc]

### Parts
ANT1  nfc_antenna  [nfc_antenna]
C43  Capacitance: 12pF  [FP-GRM155-0_05-MFG]  (hidden comment: GRM1555C1H120GA01D)
C44  Capacitance: 1uF  [FP-CL10-IPC_C]  (hidden comment: CL10B105KP8NNNC)
C45  value 62pF  [FP-GCM155-0_05-IPC_B]  (hidden comment: GCM1555C1H620GA16J)
C46  Capacitance: 100 nF  [FP-CC0603-DA-MFG]  (hidden comment: CC0603KRX7R7BB104)
R21  Resistance: 4.7kOhms  [RESC1608X55X25LL10T15]  (hidden comment: RC0603FR-074K7L)
R23  Resistance: 4.7kOhms  [RESC1608X55X25LL10T15]  (hidden comment: RC0603FR-074K7L)
R25  Resistance: 4.7kOhms  [RESC1608X55X25LL10T15]  (hidden comment: RC0603FR-074K7L)
TP11  Test Point  [test_point]  (value not drawn)
U11  ST25DV64KC-JF6D3  [PSON50P300X300X60-13N]

### Ports
NFC_GPO (out, see top[2C], mcu[2B]), NFC_LPD (in, see top[2C], mcu[2B]), SCL (bidir, see top[2C], mcu[2B], pd[2C]), SDA (bidir, see top[2C], mcu[2B], pd[2C])

### Nets
+3V3: C44.1 C46.1 R21.2 R23.2 R25.2 U11.10(VDCG) U11.12(VCC)
GND: C44.2 C46.2 TP11.1 U11.6(VSS)
SCL: R23.1 U11.8(SCL) ; port SCL
SDA: R25.1 U11.7(SDA) ; port SDA
NetANT1_1: ANT1.1 C43.2 C45.1 C45.2 U11.5(AC1)
NetC43_1: C43.1 U11.4(AC0)
NetR21_1: R21.1 U11.11(GPO) ; port NFC_GPO
NetU1_5: U11.1(LPD) ; port NFC_LPD

Not connected (* = marked no-connect by the designer): U11 2(NC) 3(V_EH) 9(NC) 13(EP)

### Notes on the sheet
- (near C45) Antenna Matching
- EP To be left floating <https://www.st.com/resource/en/datasheet/st25dv16kc.pdf>

### Library data of the parts
C43 = CMP-2008-03945-2: CAP CER 12PF 50V C0G/NP0 0402; Tolerance: 2%; Dielectric: C0G; Material: Ceramic; Termination: SMD/SMT; Mount: Surface Mount; REACH SVHC: No SVHC; Depth: 0.5mm; Case Code (Metric): 1005; Voltage Rating: 50V; Height: 0.5mm; Voltage Rating (DC): 50V; Case Code (Imperial): 0402; Package Quantity: 10000; Construction: Flat; Thickness: 0.022inch; Length: 1mm; Min Operating Temperature: -55°C; Width: 0.5mm; Lead Free: Lead Free; Case/Package: 0402; Packaging: Tape and Reel; Series: GRM; Voltage: 50V; Radiation Hardening: No; Max Operating Temperature: 125°C
C44 = CMP-2000-06094-2: as C9 on sheet mcu; Packaging: Tape and Reel; Depth: 0.8mm; Voltage Rating: 10V; Lead Free: Lead Free; Radiation Hardening: No; Length: 1.6mm; Package Quantity: 1; Mount: Surface Mount; Case/Package: 0603; Max Operating Temperature: 125°C; Case Code (Metric): 1608; Height: 0.8mm; Min Operating Temperature: -55°C; Dielectric: X7R; Contact Plating: Tin; Case Code (Imperial): 0603; Thickness: 0.035inch; Voltage Rating (DC): 10V; Tolerance: 10%; Width: 0.031inch
C45 = CMP-06035-017743-1: Ceramic Capacitor for Automotive 62pF ±2% 50VDC C0G 0402 Paper T/R
C46 = CMP-2000-05002-2: as C1 on sheet mcu; Voltage Rating: 16 V; Package: CC0603-DA; ComponentLink2Description: Datasheet; Octopart: https://octopart.com/cc0603krx7r7bb104-yageo-192941; Temperature Range High: +125°C; Digikey Description: CAP CER 0.1UF 16V X7R 0603; Voltage: 16 V; Device Class L2: Capacitors; Height: 0.9mm; Temperature: -55°C to +125°C; Manufacturer Part Number: CC0603KRX7R7BB104; Device Class L1: Passive Components; Device Class L3: Ceramic Capacitors; ComponentLink2URL: http://www.yageo.com/documents/recent/UPY-GPHC_X7R_6.3V-to-50V_18.pdf; Footprint Url: http://www.yageo.com/exep/pages/download/literatures/UPY-C_GEN_24.pdf; RoHS: TRUE; Temperature Range Low: -55°C; Temperature Characteristic: X7R; Lead Free: Yes; Category: Cap; Mouser Description: Multilayer Ceramic Capacitor, CC Series, 0.1 - F, - 10%, X7R, 16 V, 0603 [1608 Metric]; Automotive: No
R21 R23 R25 = CMP-2000-06942-1: as R8 on sheet mcu; Package Reference: 0603; Series: RC; Datasheet Version: Rev. 7, 05/2017; Packaging: Reel; Termination Style: SMD/SMT; Datasheet URL: http://www.yageo.com/documents/recent/PYu-RC_Group_51_RoHS_L_7.pdf; Manufacturer URL: http://www.yageo.com/; Package Description: 2-Pin Surface Mount Device, Body 1.6 x 0.8 mm; Case Code - mm: 1608; Case Code - in: 0603; Mounting Technology: SurfaceMount; Operating Temperature Range: -55Cto+155C; Tolerance: 1%; Product: ThickFilmResistorsGeneralPurpose